# EAGLE design source_eagle (EAGLE 9.6.2)
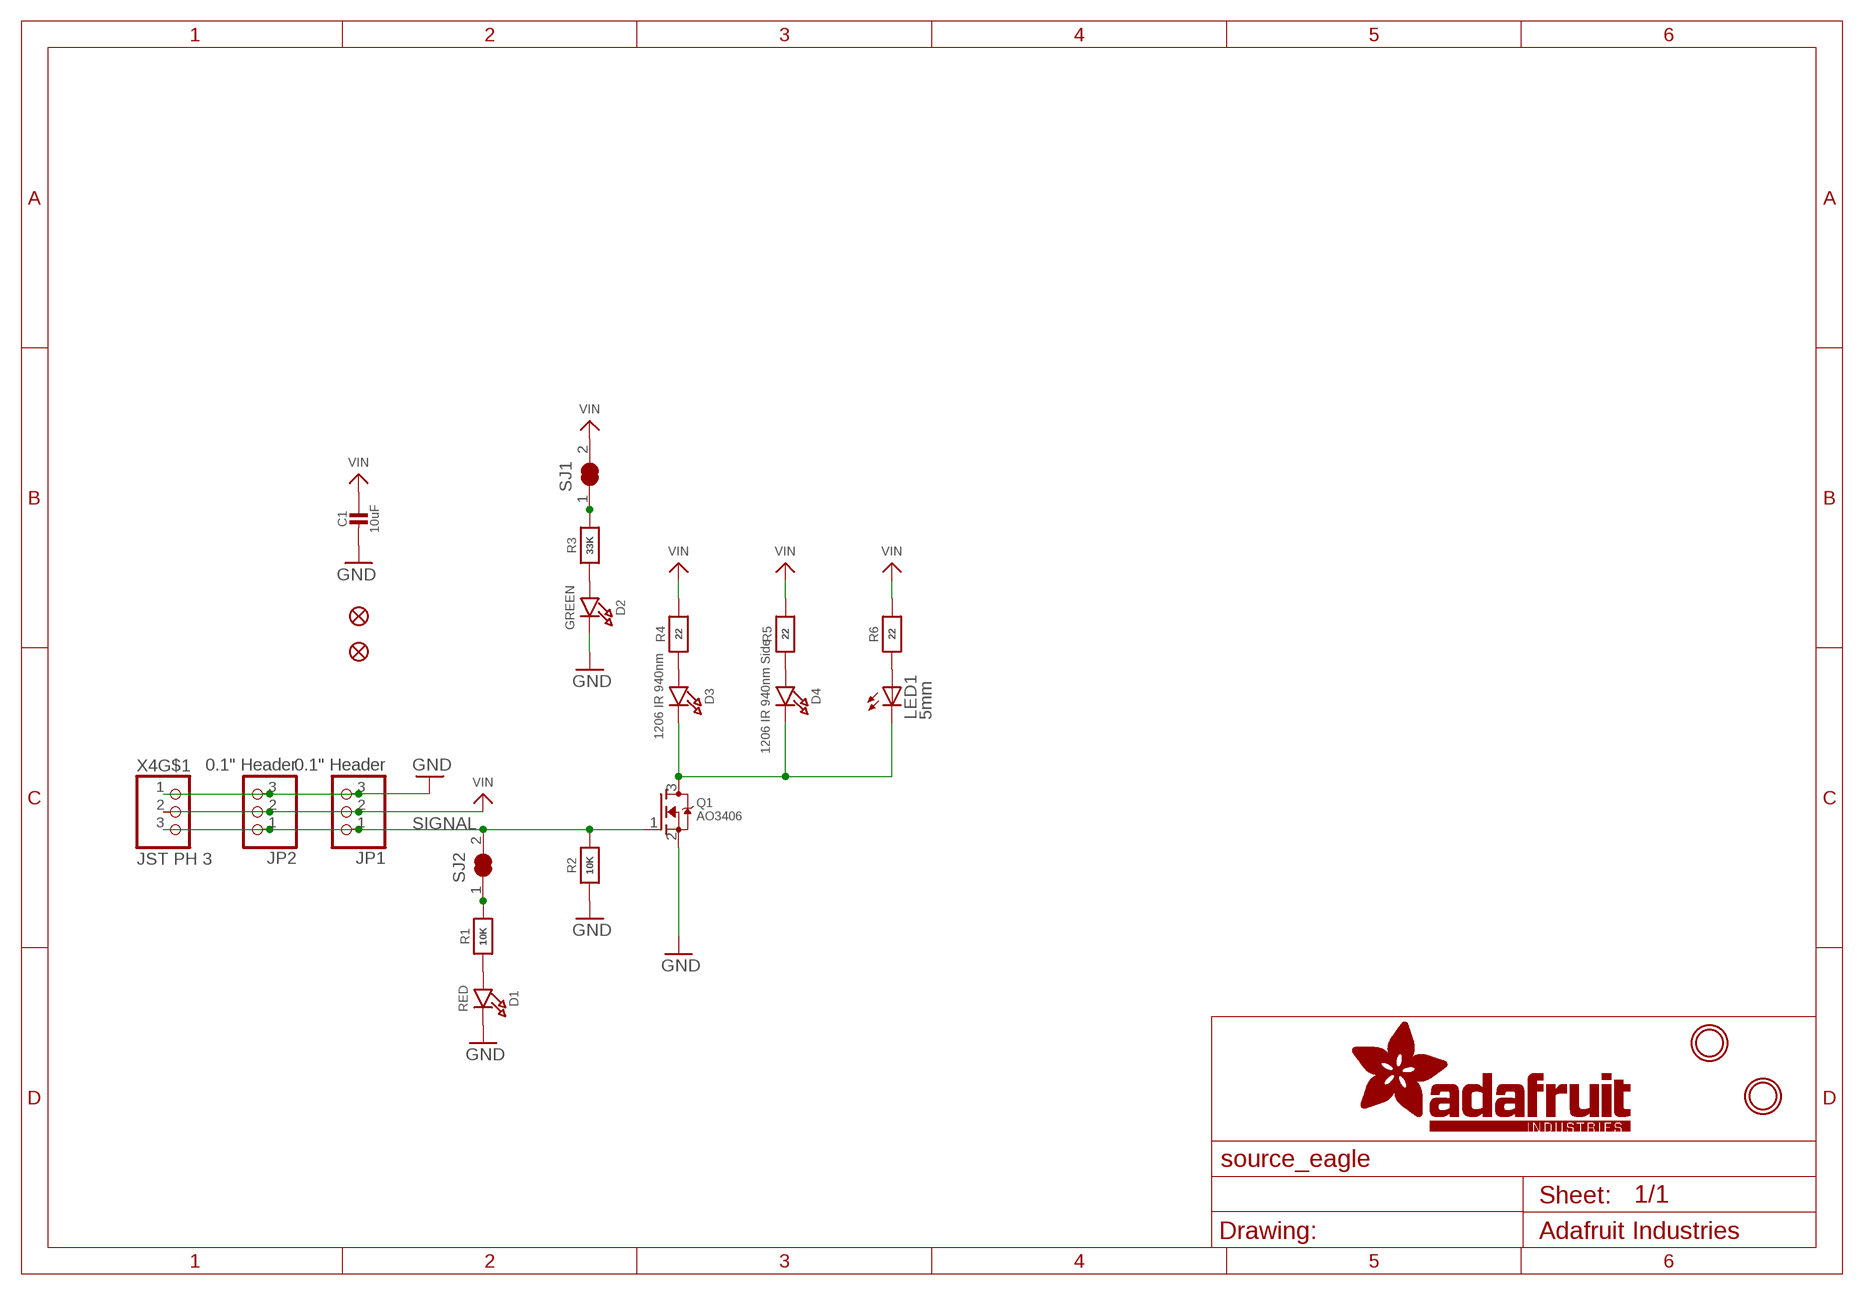
[diagram p0: schematic, sheet 1]

## Parts
C1  10uF  CAP_CERAMIC0805-NOOUTLINE  [0805-NO]
D1  RED  LED0603_NOOUTLINE  [CHIPLED_0603_NOOUTLINE]
D2  GREEN  LED0603_NOOUTLINE  [CHIPLED_0603_NOOUTLINE]
D3  1206 IR 940nm  LED1206  [CHIPLED_1206]
D4  1206 IR 940nm Side  LED_1206RA  [LED_1206_SIDE]
FID2  FIDUCIAL_1MM  [FIDUCIAL_1MM]
FID3  FIDUCIAL_1MM  [FIDUCIAL_1MM]
JP1  0.1" Header  HEADER-1X3  [1X03_OVAL]
JP2  0.1" Header  HEADER-1X3ROUND  [1X03_ROUND]
LED1  5mm  LED5MM  [LED5MM]
Q1  AO3406  MOSFET-NWIDE  [SOT23-WIDE]
R1  10K  RESISTOR_0603_NOOUT  [0603-NO]
R2  10K  RESISTOR_0603_NOOUT  [0603-NO]
R3  33K  RESISTOR_0603_NOOUT  [0603-NO]
R4  22  RESISTOR_0603_NOOUT  [0603-NO]
R5  22  RESISTOR_0603_NOOUT  [0603-NO]
R6  22  RESISTOR_0603_NOOUT  [0603-NO]
SJ1  SOLDERJUMPER_CLOSED  [SOLDERJUMPER_CLOSEDWIRE]
SJ2  SOLDERJUMPER_CLOSED  [SOLDERJUMPER_CLOSEDWIRE]
U$1  MOUNTINGHOLE2.5  [MOUNTINGHOLE_2.5_PLATED]
U$8  MOUNTINGHOLE2.5  [MOUNTINGHOLE_2.5_PLATED]
X4  JST PH 3  CON_JST_PH_3PIN  [JSTPH3]

## Nets
GND: C1.2 D1.C D2.C JP1.3 JP2.3 Q1.2(S) R2.1 X4.1
N$1: R3.2 SJ1.1
N$2: D1.A R1.1
N$3: R1.2 SJ2.1
N$4: D3.C D4.C LED1.K(C) Q1.3(D)
N$5: D3.A R4.1
N$6: D4.A R5.1
N$7: LED1.A R6.1
N$26: D2.A R3.1
SIGNAL: JP1.1 JP2.1 Q1.1(G) R2.2 SJ2.2 X4.3
VIN: C1.1 JP1.2 JP2.2 R4.2 R5.2 R6.2 SJ1.2 X4.2
Unconnected: X4.NC1(MT) X4.NC2(MT)

## Library data of the parts
C1 = microbuilder:CAP_CERAMIC: Ceramic Capacitors For new designs, use the packages preceded by an '_' character since they are more reliable: The following footprints should be used on most boards: _0402 - Standard footprint for regular board layouts _0603 - Standard footprint for regular board layouts _0805 - Standard footprint for regular board layouts _1206 - Standard footprint for regular board layouts For extremely tight-pitch boards where space is at a premium, the following 'micro-pitch' footprints can be used (smaller pads, no silkscreen outline, etc.): _0402MP - Micro-pitch footprint for very dense/compact boards _0603MP - Micro-pitch footprint for very dense/compact boards _0805MP - Micro-pitch footprint for very dense/compact boards _1206MP - Micro-pitch footprint for very dense/compact boards
D1 D2 = microbuilder:LED: LED; ROT: 270
D3 D4 = microbuilder:LED: LED
FID2 FID3 = microbuilder:FIDUCIAL: Fiducial Alignment Points Various fiducial points for machine vision alignment.; BOM: EXCLUDE
JP1 JP2 = microbuilder:HEADER-1X3: PIN HEADER
LED1 = adafruit:LED: LED
Q1 = microbuilder:MOSFET-N: N-Channel Mosfet LEGEND VDS: Voltage Drain-Source ID: Drain Current RDS(ON): Drain-Source On-State Resistance VGS(TH): Gate-Source Threshold Voltage CISS: Drain-Source Input Capacitance SOT-23 Name VDS ID RDS(ON) VGS(TH) CISS Order Number 2N7002E 60V 260mA 2.5 Ohm 2.5V @ 250uA 26.7pF @ 25V 2N7002ET1GOSTR-ND BSH103 30V 850mA 400 mOhm 400mV @ 1mA 83pF @ 24V BSH103,235-ND BSS138 60V 320mA 1.6 Ohm 1.5V @ 250uA 50pF @ 10V Mouser: 771-BSS138PW115 DMN2075U-7 20V 4.2A 38 mOhm 1V @ 250 uA 594.3pF @ 10V DMN2075U-7DICT-ND * BSS138 good choice for I2C level-shifting POWERPAK 1212-8 Name VDS ID RDS(ON) VGS(TH) CISS Order Number Si7308DN 60V 6A 58 mOhm 3V @ 250uA 665pF @ 15V SI7308DN-T1-E3CT-ND
R1-R6 = microbuilder:RESISTOR: Resistors For new designs, use the packages preceded by an '_' character since they are more reliable: The following footprints should be used on most boards: _0402 - Standard footprint for regular board layouts _0603 - Standard footprint for regular board layouts _0805 - Standard footprint for regular board layouts _1206 - Standard footprint for regular board layouts For extremely tight-pitch boards where space is at a premium, the following 'micro-pitch' footprints can be used (smaller pads, no silkscreen outline, etc.): _0402MP - Micro-pitch footprint for very dense/compact boards _0603MP - Micro-pitch footprint for very dense/compact boards _0805MP - Micro-pitch footprint for very dense/compact boards _1206MP - Micro-pitch footprint for very dense/compact boards
SJ1 SJ2 = microbuilder:SOLDERJUMPER_CLOSED: Solder Jumper - Closed These solder jumpers are closed by default CLOSEDWIRE - 10 mil trace between pads that can be cut and resoldered later CLOSEDPERM - 63 mil trace between pads for a permanent connection (used to 'bridge' two signals, a shameless hack for Eagle). Can double as a test point as well (no cream layer)
U$1 U$8 = adafruit_electromech:MOUNTINGHOLE: Mounting Hole For #2 screws (0.086"/2.18mm width, 0.094"/2.4mm hole) use 2.5mm; BOM: EXCLUDE
X4 = adafruit_electromech:CON_JST_PH_3PIN

## Net classes
1 HV: width 0.406 mm, drill 0.381 mm, clearance 0.762 mm

## Board
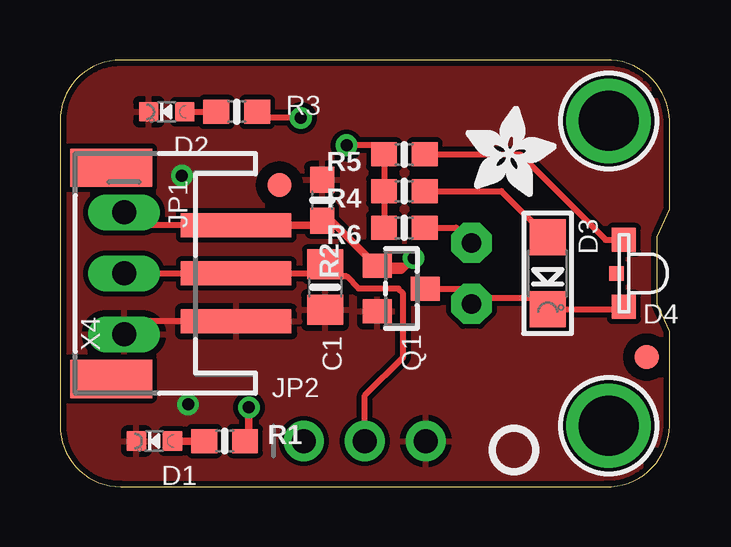
[diagram p1: board, top side]
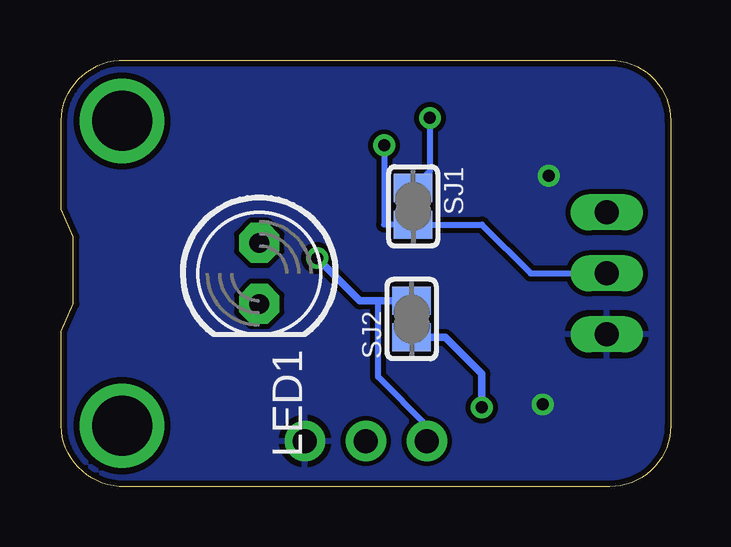
[diagram p2: board, bottom side, seen from below]

Size 25.4 x 17.78 mm. Coordinates in mm from the lower left corner, seen from the top.
Outline: 0,15.24 0,2.54 arc90 2.54,0 22.73,0 arc90 25.4,2.54 25.4,6.48 24.89,7.62 24.89,10.41 25.4,11.56 25.4,15.24 arc90 22.73,17.78 2.54,17.78 arc90 0,15.24
Copper layers (1*16): Top 0.035mm / dielectric 1.5mm / Bottom 0.035mm
Design rules "adafruit": minimum track width 8mil, minimum drill 15.5mil, track to track 8mil, track to pad 8mil, pad to pad 8mil, via to via 8mil, smd to smd 8mil, copper to edge 10mil, drill to drill 8mil, minimum pad ring 10mil, minimum via ring 8mil, stop-mask expansion 2mil, vias tented up to drill 20mil, thermal gap 10mil

### Footprints (pad centres in the part's own frame; a part is rotated, then mirrored left to right if it is on the bottom)
0805-NO = smd 1.24 x 1.5: 1 -0.95,0; 2 0.95,0
CHIPLED_0603_NOOUTLINE = smd 0.8 x 0.8: A 0,-0.75; C 0,0.75
CHIPLED_1206 = smd 1.5 x 1.5: A 0,-1.496; C 0,1.496
LED_1206_SIDE = smd 1 x 1: A 1.4,0; C -1.4,0 | smd 0.6 x 0.6: MT 0,0.3
FIDUCIAL_1MM = smd 1 x 1: 1 0,0
1X03_OVAL = drill 1 long: 1 -2.54,0; 2 0,0; 3 2.54,0
1X03_ROUND = drill 1 pad 1.676: 1 -2.54,0; 2 0,0; 3 2.54,0
LED5MM = drill 0.813 pad 1.676 octagon: A -1.27,0; K 1.27,0
SOT23-WIDE = smd 1 x 1.2: 1 -0.95,-1; 2 0.95,-1; 3 0,1
0603-NO = smd 1.075 x 1: 1 -0.85,0; 2 0.85,0
SOLDERJUMPER_CLOSEDWIRE = smd 1.168 x 1.6: 1 -0.762,0; 2 0.762,0 | smd 0.635 x 0.203: WIRE 0,0
MOUNTINGHOLE_2.5_PLATED = drill 2.5 pad 3.2: P$1 0,0
JSTPH3 = smd 1 x 4.6: 1 -2,-2.7; 2 0,-2.7; 3 2,-2.7 | smd 1.6 x 3.4: NC1 -4.4,2.5; NC2 4.4,2.5

### Placement (x,y rotation side)
C1  11.05,8.32 270 top
D1  3.94,1.91 90 top
D2  4.45,15.62 90 top
D3  20.32,8.89 180 top
D4  23.5,8.89 90 top
FID2  9.14,12.57 0 top
FID3  24.45,5.4 0 top
JP1  2.67,8.89 270 top
JP2  12.7,1.91 0 top
LED1  17.14,8.89 270 bottom
PLABEL0  [PLABEL0]  0.64,15.11 0 top
PLABEL00  [PLABEL00]  9.4,3.43 0 bottom
PLABEL1  [PLABEL1]  0.51,1.52 0 top
PLABEL2  [PLABEL2]  9.65,2.92 0 top
PLABEL3  [PLABEL3]  11.05,14.48 0 top
PLABEL4  [PLABEL4]  20.95,5.08 90 bottom
PLABEL5  [PLABEL5]  12.45,5.84 90 bottom
PLABEL6  [PLABEL6]  12.06,10.54 90 bottom
PLABEL7  [PLABEL7]  4.45,11.43 0 bottom
PLABEL8  [PLABEL8]  4.45,8.89 0 bottom
PLABEL9  [PLABEL9]  4.45,6.35 0 bottom
PLABEL10  [PLABEL10]  1.78,16.64 0 bottom
PLABEL11  [PLABEL11]  2.03,14.22 0 bottom
PLABEL13  [PLABEL13]  11.43,3.43 0 bottom
PLABEL14  [PLABEL14]  13.97,3.43 0 bottom
Q1  14.22,8.26 270 top
R1  6.86,1.91 0 top
R2  10.92,11.94 270 top
R3  7.37,15.62 0 top
R4  14.35,12.32 180 top
R5  14.35,13.84 180 top
R6  14.35,10.79 180 top
SJ1  10.73,11.68 270 bottom
SJ2  10.79,6.99 90 bottom
U$1  22.86,2.54 0 top
U$5  [PCBFEAT-REV-040]  18.92,1.52 180 top
U$8  22.86,15.24 0 top
U$10  [ADAFRUIT_3.5MM]  16.89,12.06 0 top
X4  4.64,8.89 90 top

### Tracks (layer width: path | path; a pad name or v marks a point on that pad's centre or on a via)
GND  (via drill 0.5)
  Top 0.254: X4.1 3.21,6.89 JP1.3
  other vias: 5.08,12.95 5.33,3.43
  pour Top: 0,17.78 25.4,17.78 25.4,0 0,0
  pour Bottom: 0,17.78 25.4,17.78 25.4,0 0,0
N$1  (via drill 0.5)
  Top 0.254: v10.03,15.37 8.47,15.37 R3.2
  Bottom 0.254: v10.03,15.37 10.03,13.14 SJ1.1
N$2
  Top 0.305: R1.1 D1.A
N$3  (via drill 0.5)
  Top 0.305: v7.87,3.3 7.87,1.91 R1.2
  Bottom 0.305: v7.87,3.3 7.87,4.7 9.4,6.22 SJ2.1
N$4
  Top 0.254: Q1.3 17.14,8.26 17.14,7.87 | 17.14,7.87 19.84,7.87 D3.C 23.4,7.39 D4.C | LED1.K 17.14,7.87
N$5
  Top 0.254: R4.1 18.39,12.32 D3.A
N$6
  Top 0.254: R5.1 19.18,13.84 22.73,10.29 D4.A
N$7
  Top 0.254: R6.1 16.51,10.79 LED1.A
N$26
  Top 0.254: D2.A R3.1
SIGNAL  (via drill 0.5)
  Top 0.254: X4.3 3.21,10.89 JP1.1 | v14.73,9.53 14.41,9.21 Q1.1
  Top 0.305: X4.3 10.92,10.89 R2.2 11.3,11.09 13.37,9.02 14.22,9.02 v14.73,9.53
  Bottom 0.254: JP2.1 10.16,2.54 12.19,4.57 12.19,7.75
  Bottom 0.305: v14.73,9.53 12.95,7.75 12.19,7.75 SJ2.2
VIN  (via drill 0.5)
  Top 0.254: 11.56,8.76 11.94,8.76 12.44,8.26 14.1,8.26 14.29,8.06 14.29,5.4 12.7,3.81 JP2.2 | 11.56,8.76 11.43,8.76 10.92,9.27 C1.1 | 11.56,8.76 11.43,8.89 X4.2 JP1.2 | v11.94,14.22 13.12,14.22 R5.2 R4.2 R6.2
  Bottom 0.254: JP1.2 5.84,8.89 7.87,10.92 SJ1.2 11.94,10.92 v11.94,14.22

### Text on the board
Pinguin_tBackup: ON | Signal High / To Send | 940nm Infrared / LED Emitters | Sig
Pinguin_bBackup: Logic/Power: 3~5VDC | 100mA+ Current/LED | In | On | V+ | GND | Sig | Optional / 5mm LED | In | V+ | GND